# EAGLE design BMP180 Breakout PCB Rev B (EAGLE 5.11)
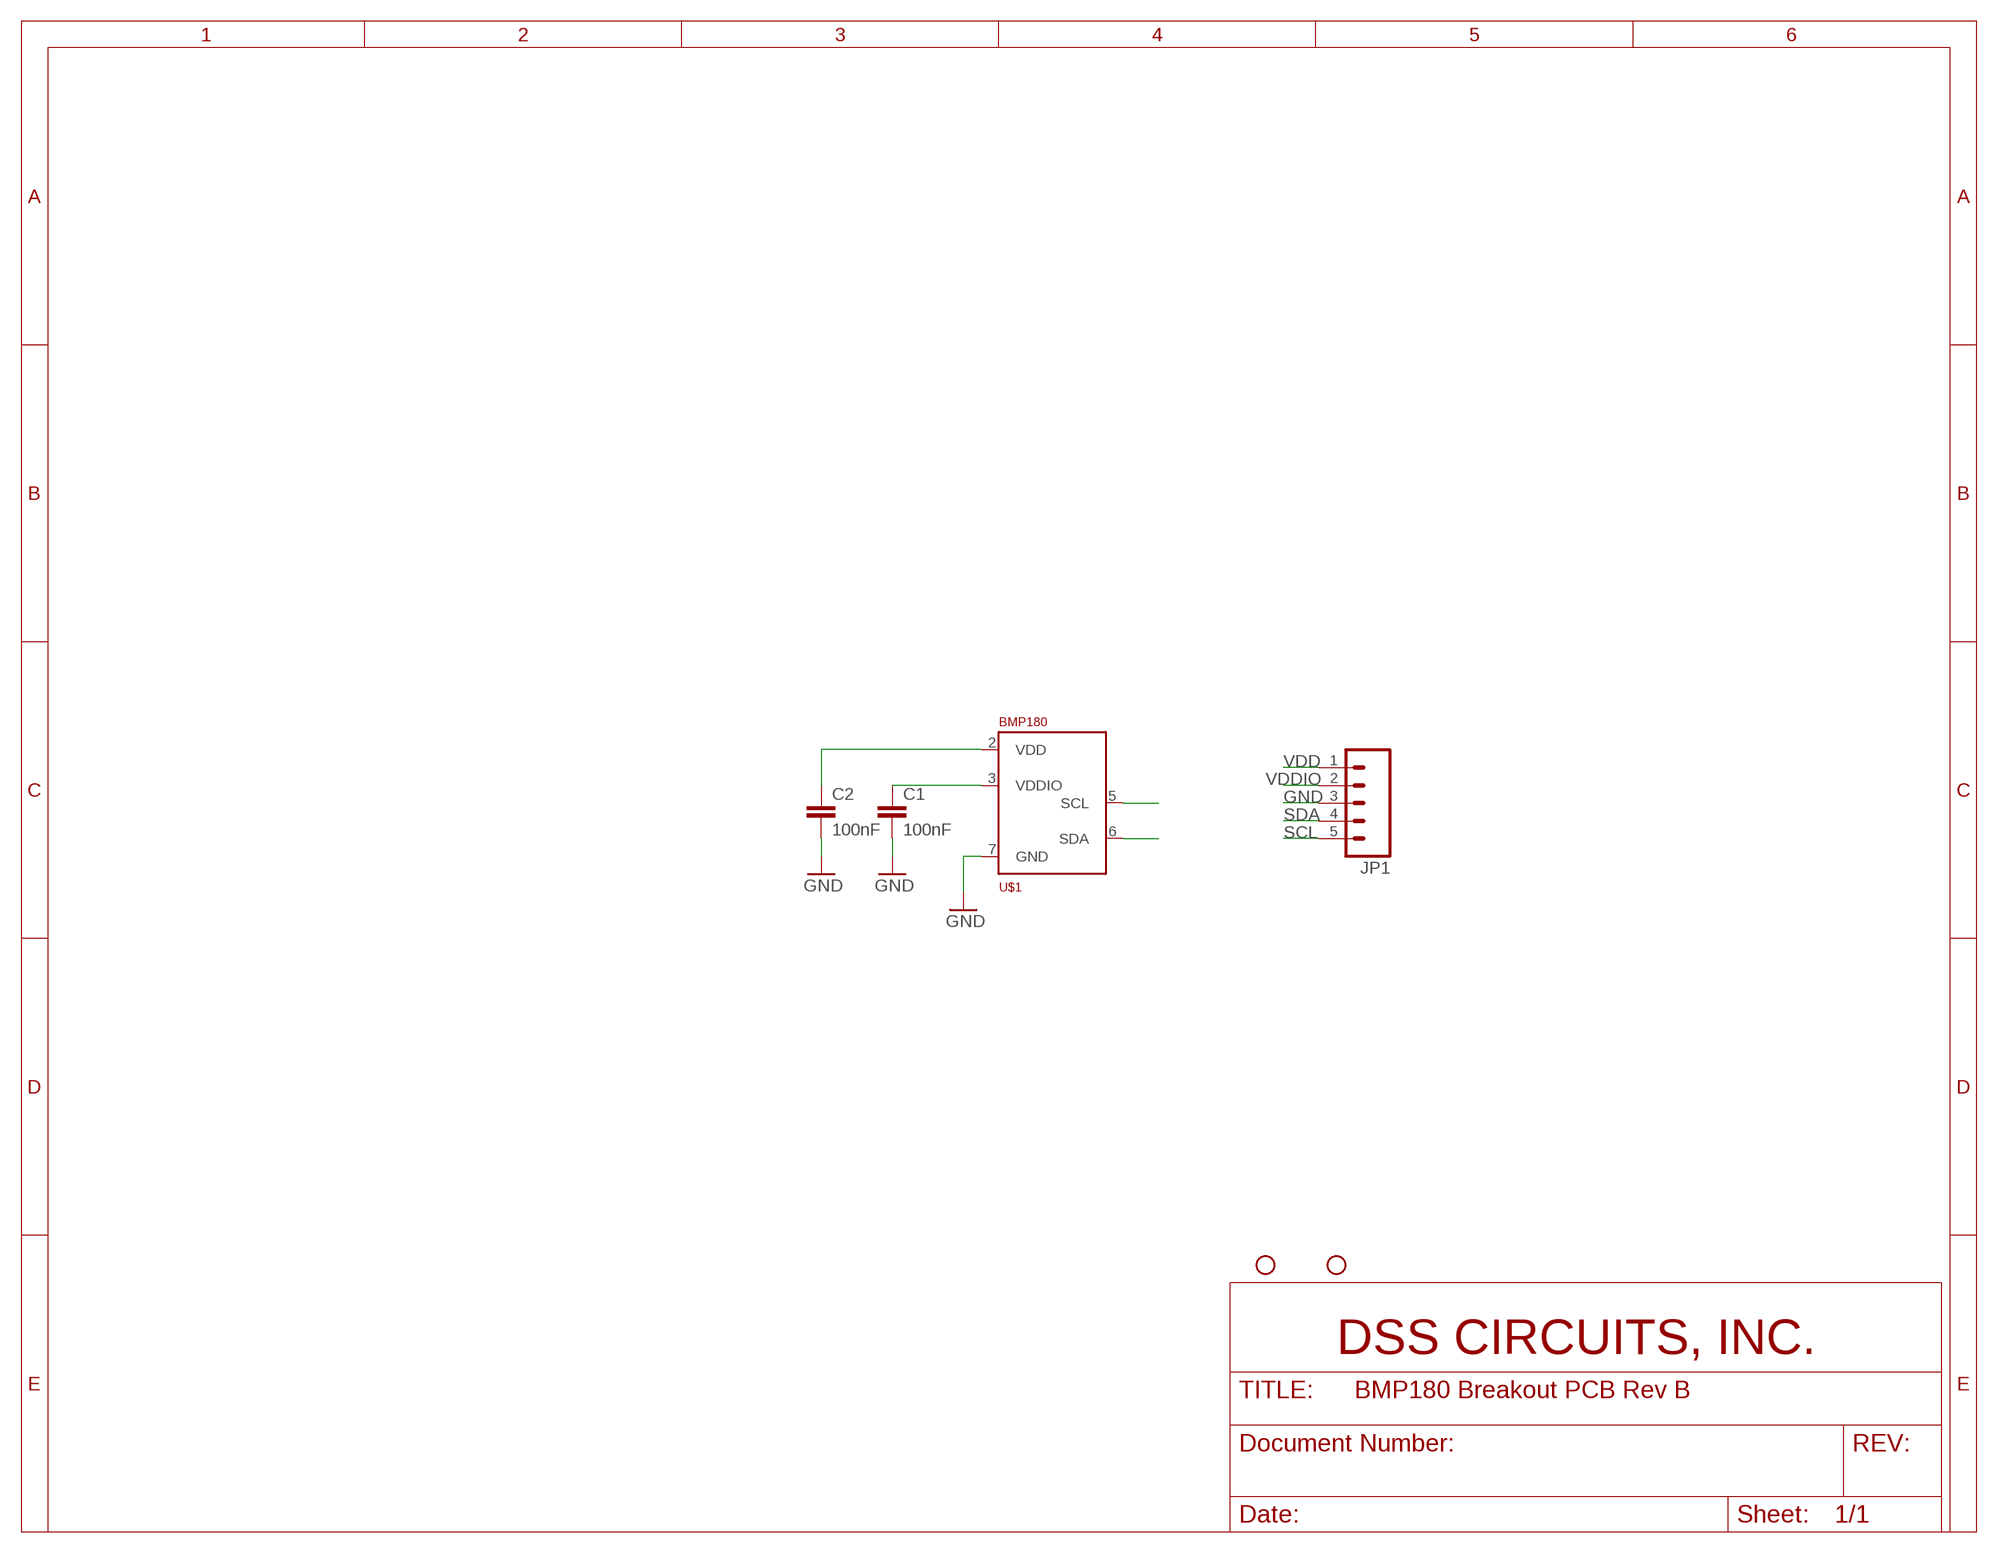
[diagram p0: schematic, sheet 1]

## Parts
C1  100nF  C-EUC0603  [C0603]
C2  100nF  C-EUC0603  [C0603]
JP1  M05PTH  [1X05]
JP2  STAND-OFF  [STAND-OFF]
JP3  STAND-OFF  [STAND-OFF]
U$1  BMP180  [LGA7]

## Nets
GND: C1.2 C2.2 JP1.3 U$1.7(GND)
SCL: JP1.5 U$1.5(SCL)
SDA: JP1.4 U$1.6(SDA)
VDD: C2.1 JP1.1 U$1.2(VDD)
VDDIO: C1.1 JP1.2 U$1.3(VDDIO)
Unconnected: U$1.1 U$1.4

## Library data of the parts
C1 C2 = resistor:C-EU: CAPACITOR, European symbol
JP1 = SparkFun:M05: Header 5 Standard 5-pin 0.1" header. Use with straight break away headers (SKU : PRT-00116), right angle break away headers (PRT-00553), swiss pins (PRT-00743), machine pins (PRT-00117), and female headers (PRT-00115). Molex polarized connector foot print use with SKU : PRT-08230 with associated crimp pins and housings.
JP2 JP3 = DSSCircuits:STAND-OFF: Stand Off This is the mechanical footprint for a #4 phillips button head screw. Use the keepout ring to avoid running the screw head into surrounding components. SKU : PRT-00447
U$1 = DSSCircuits:BMP180; I2C: I2C

## Board
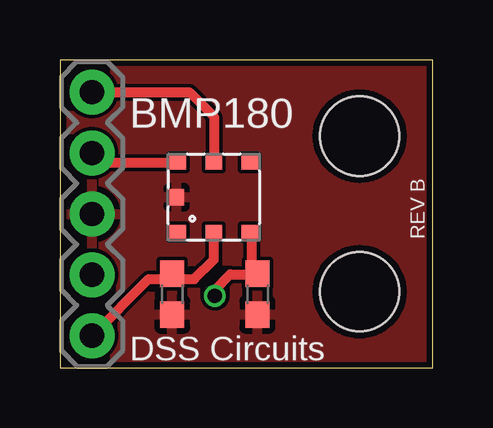
[diagram p1: board, top side]
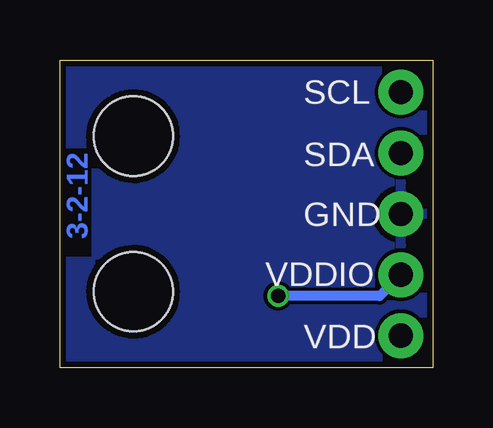
[diagram p2: board, bottom side, seen from below]

Size 15.56 x 12.85 mm. Coordinates in mm from the lower left corner, seen from the top.
Outline: 0,0 15.56,0 15.56,12.85 0,12.85 0,0
Copper layers (1*16): Top 0.035mm / dielectric 1.5mm / Bottom 0.035mm
Design rules "Fusion_eagle_rule_v1.1": minimum track width 6mil, minimum drill 12mil, track to track 6mil, track to pad 6mil, pad to pad 6mil, via to via 6mil, smd to smd 0mil, copper to edge 10mil, drill to drill 10mil, minimum pad ring 10mil, minimum via ring 6mil, stop-mask expansion 2mil, vias tented up to drill 100mil, thermal gap 10mil

### Footprints (pad centres in the part's own frame; a part is rotated, then mirrored left to right if it is on the bottom)
C0603 = smd 1.1 x 1: 1 -0.85,0; 2 0.85,0
1X05 = drill 1.016 pad 1.88 round: 1 0,0; 2 2.54,0; 3 5.08,0; 4 7.62,0; 5 10.16,0
STAND-OFF = hole 3.302: 0,0
LGA7 = smd 0.7 x 0.6: 1 -1.5,-1.45; 2 0,-1.45; 3 1.5,-1.45; 4 1.5,1.45; 5 0,1.45; 6 -1.5,1.45 | smd 0.6 x 0.7: 7 -1.55,0

### Placement (x,y rotation side)
C1  8.23,3.08 270 top
C2  4.68,3.08 270 top
JP1  1.34,1.34 90 top
JP2  12.5,9.66 0 top
JP3  12.5,3.17 0 top
U$1  6.42,7.12 0 top

### Tracks (layer width: path | path; a pad name or v marks a point on that pad's centre or on a via)
GND
  pour Top: 0.4,0.4 15.16,0.4 15.16,12.45 0.4,12.45
  pour Bottom: 0.4,0.4 15.16,0.4 15.16,12.45 0.4,12.45
SCL
  Top 0.406: U$1.5 6.42,10.48 5.4,11.5 JP1.5
SDA
  Top 0.406: U$1.6 1.73,8.57 JP1.4
VDD
  Top 0.406: U$1.2 6.42,4.52 5.6,3.7 4.81,3.7 | 4.81,3.7 C2.1 | 4.81,3.7 3.7,3.7 JP1.1
VDDIO  (via drill 0.6)
  Top 0.406: 7.94,5.67 U$1.3 8,5.59 8,4.3 8.23,4.07 C1.1 | C1.1 8.52,3.73 | v6.46,3 6.46,3.26 7.1,3.9 8.21,3.9 C1.1
  Bottom 0.406: v6.46,3 2.22,3 JP1.2

### Text on the board
Bottom: 3-2-12
tPlace: BMP180 | REV B | DSS Circuits
bPlace: SCL | SDA | GND | VDDIO | VDD